# EasyEDA Pro project 2025NUEDC_A_Project.eprj, board PCB1_1
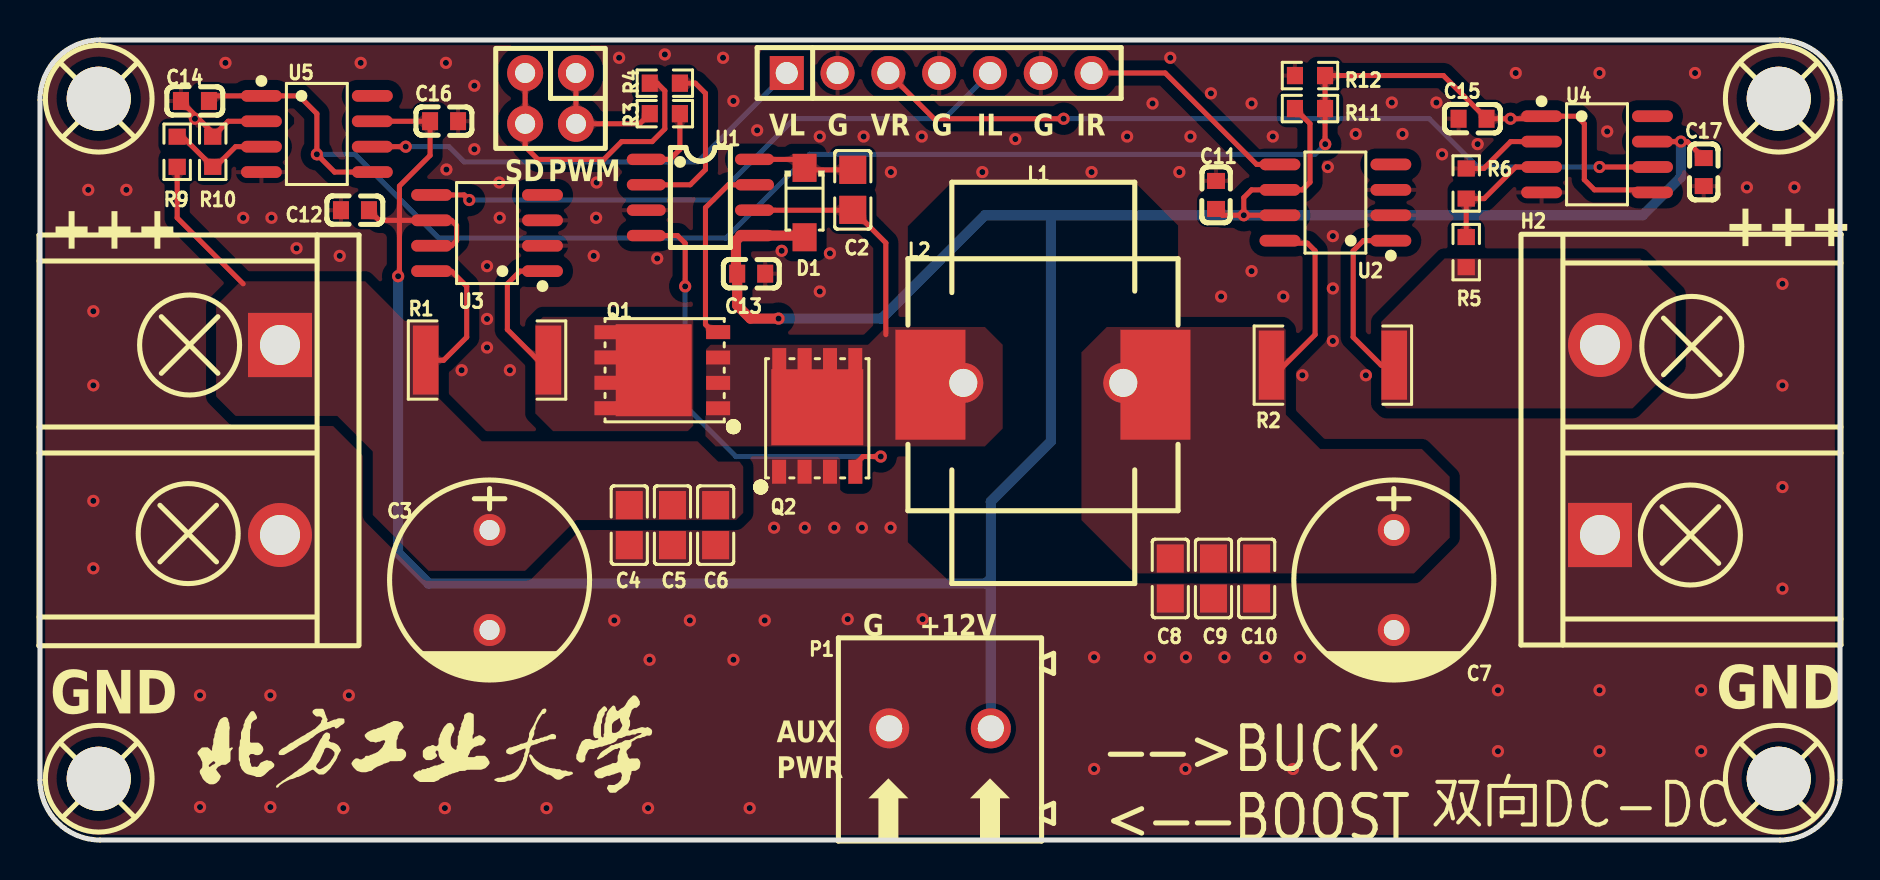
[diagram p3: board, top side]
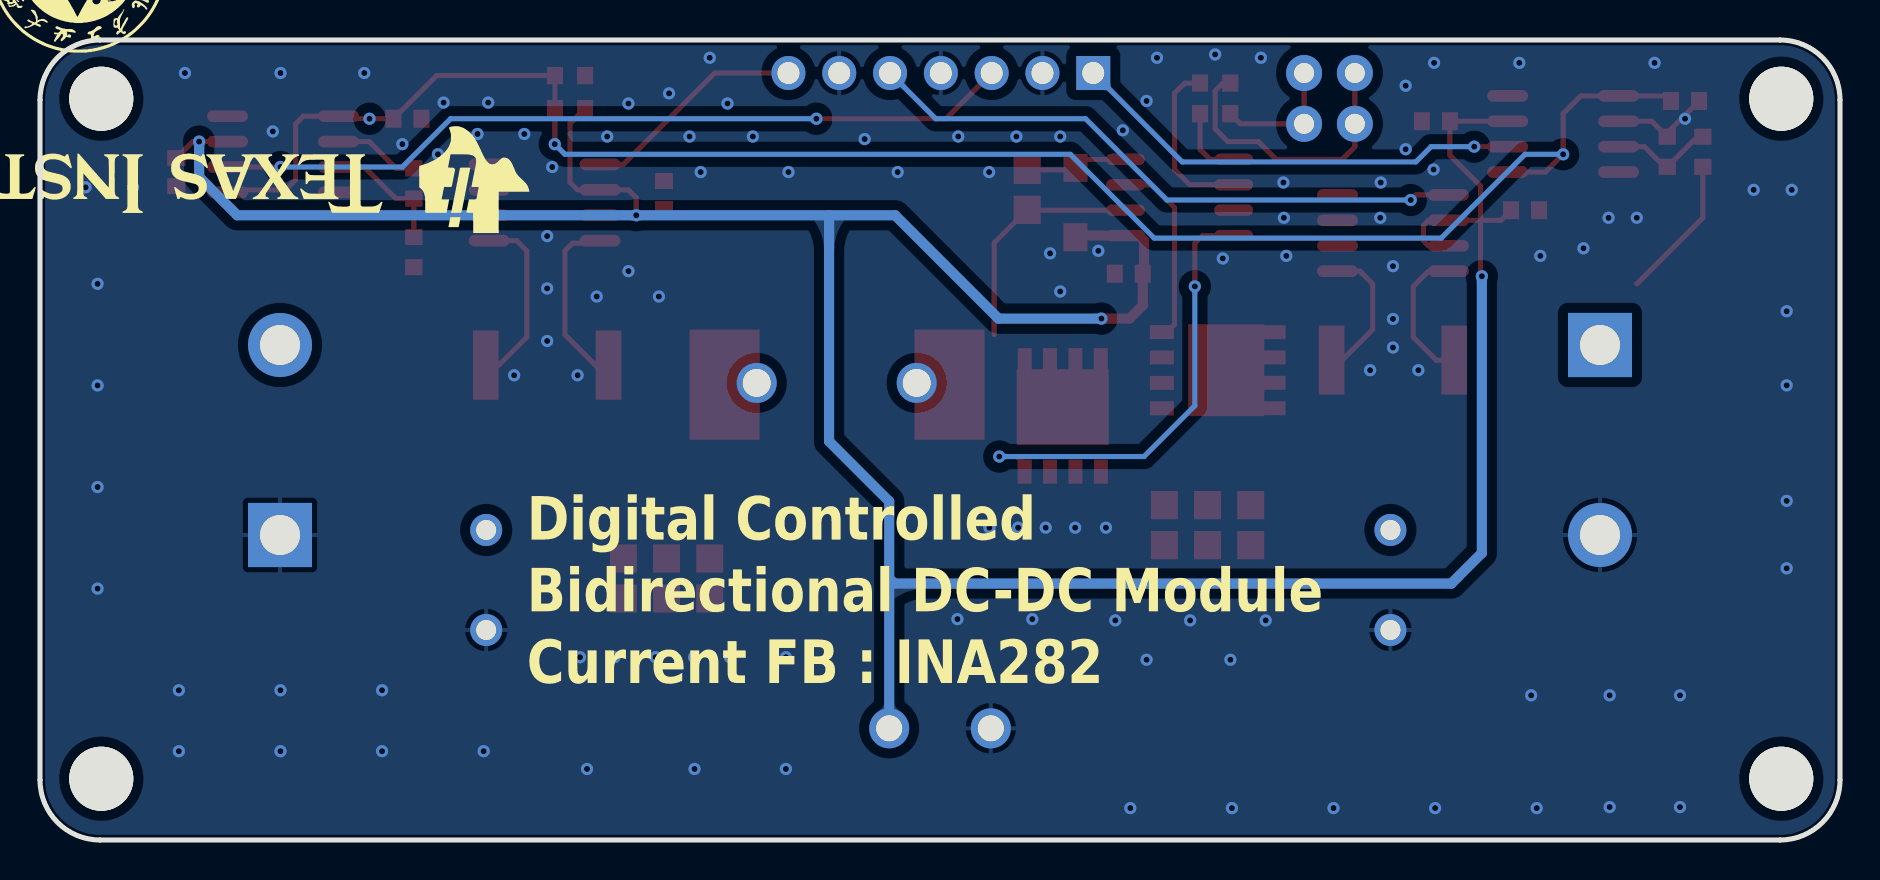
[diagram p4: board, bottom side, seen from below]

Outline 90 x 40 mm; copper layers: Top Layer, Bottom Layer. Coordinates in mm from the lower left corner of the outline.
Outline path: 0,37 0,3 arc(0.88,0.88) 3,0 87,0 arc(89.12,0.88) 90,3 90,37 arc(89.12,39.12) 87,40 3,40 arc(0.88,39.12) 0,37
Stack: Top Layer 0.035mm / Dielectric1 1.51mm FR4 er 4.5 / Bottom Layer 0.035mm

## Design rules (mm)
template: 自定义配置
spacing copperThickness1oz (default): track to track 0.102, other pairs 0.152 to 0.3
spacing copperThickness2oz: track to track 0.203, other pairs 0.152 to 0.3
track width copperThickness1oz (default): min 0.127, default 0.254, max 2.54
track width copperThickness2oz: min 0.203, default 0.254, max 2.54
differential pair differentialPair (default): width min 0.127, default 0.254, max 2.54; gap min 0.152, default 0.152
via viaSize (default): diameter min 0.5, default 0.61, max 10; hole min 0.3, default 0.305, max 6.3
pour e29 uses copperRegion1
pour e724 uses copperRegion

## Placement (name value [footprint] x y rotation side)
C2  100nF  [C0805]  40.64 32.51 270 top
C3  1000uF  [CAP-TH_BD10.0-P5.00-D0.6-FD]  22.48 13 270 top
C4  100nF  [C0805]  29.46 15.74 90 top
C5  100nF  [C0805]  31.62 15.74 90 top
C6  100nF  [C0805]  33.78 15.74 90 top
C7  1000uF  [CAP-TH_BD10.0-P5.00-D0.6-FD]  67.69 13 270 top
C8  100nF  [C0805]  56.51 13.08 90 top
C9  100nF  [C0805]  58.67 13.08 90 top
C10  100nF  [C0805]  60.83 13.08 90 top
C11  100nF  [C0603]  58.8 32.25 270 top
C12  100nF  [C0603]  15.75 31.49 0 top
C13  100nF  [C0603]  35.56 28.32 180 top
C14  10nF  [C0603]  7.75 36.95 0 top
C15  10nF  [C0603]  71.63 36.06 0 top
C16  100nF  [C0603]  20.2 35.94 0 top
C17  100nF  [C0603]  83.19 33.4 270 top
D1  DSK34  [SOD-123FL_L2.7-W1.8-LS3.8-RD]  38.23 31.87 270 top
H1  HB9500M-9.5-2P  [CONN-TH_HB9500M-9.5-2P]  12 20 270 top
H2  HB9500M-9.5-2P  [CONN-TH_HB9500M-9.5-2P]  78 20 90 top
H3  -  [HDR-TH_4P-P2.54-V-F-R2-C2-S2.54]  25.53 37.08 180 top
H5  -  [HDR-TH_7P-P2.54-V-M]  44.96 38.35 0 top
L1  47uH  [IND-TH_L20.0-W9.0-P8.00-D1.0]  50.16 22.86 0 top
L2  10uH  [IND-SMD_L13.5-W12.6_FAUL136X]  50.15 22.76 0 top
P1  WJ500V-5.08-2P  [CONN-TH_2P-P5.00_WJ500V-5.08-2P]  45 5.58 180 top
Q1  CJAC13TH06  [PDFN-8_L5.8-W4.9-P1.27-LS6.1-BL]  31.12 23.49 90 top
Q2  CJAC13TH06  [PDFN-8_L5.8-W4.9-P1.27-LS6.1-BL]  38.86 21.2 0 top
R1  10mΩ  [R2512]  22.35 24 0 top
R2  10mΩ  [R2512]  64.64 23.74 0 top
R3  22  [R0603]  31.24 36.32 0 top
R4  22  [R0603]  31.24 37.84 0 top
R5  90k  [R0603]  71.31 29.4 270 top
R6  10K  [R0603]  71.31 32.82 270 top
R9  90k  [R0603]  6.86 34.41 270 top
R10  10K  [R0603]  8.64 34.41 270 top
R11  1k  [R0603]  63.5 36.57 180 top
R12  1k  [R0603]  63.5 38.22 0 top
TP1  -  [M3螺丝]  3 37 0 top
TP2  -  [M3螺丝]  3 3 0 top
TP3  -  [M3螺丝]  87 37 0 top
TP4  -  [M3螺丝]  87 3 0 top
U1  IR2184STRPBF  [SOIC-8_L5.0-W4.0-P1.27-LS6.0-BL]  33.02 32.13 270 top
U2  INA282AIDR  [SOIC-8_L4.9-W3.9-P1.27-LS6.0-BL]  64.77 31.87 90 top
U3  INA282AIDR  [SOIC-8_L4.9-W3.9-P1.27-LS6.0-BL]  22.35 30.35 90 top
U4  INA149AIDR  [SOIC-8_L4.9-W3.9-P1.27-LS6.0-BL]  77.85 34.28 270 top
U5  INA149AIDR  [SOIC-8_L4.9-W3.9-P1.27-LS6.0-BL]  13.84 35.3 270 top

## Footprints (pads in the part's own frame, mm; a bottom-side part is the same pattern mirrored in y, then rotated)
C0603
  rect 0.8x0.9 smd: 1(-0.7,0) 2(0.7,0)
C0805
  rect 1.41x1.35 smd: 1(-1,0) 2(1,0)
CAP-TH_BD10.0-P5.00-D0.6-FD
  round 1.6 hole 1: 1(-2.5,0) 2(2.5,0)
CONN-TH_2P-P5.00_WJ500V-5.08-2P
  round 2 hole 1.3: 1(-2.54,0) 2(2.54,0)
CONN-TH_HB9500M-9.5-2P
  rect 3.21x3.2 hole 2: 1(-4.75,0)
  round 3.2 hole 2: 2(4.75,0)
HDR-TH_4P-P2.54-V-F-R2-C2-S2.54
  round 1.8 hole 1: 1(-1.27,-1.27) 2(-1.27,1.27) 3(1.27,-1.27) 4(1.27,1.27)
HDR-TH_7P-P2.54-V-M
  rect 1.7x1.7 hole 1.1: 1(-7.62,0)
  round 1.7 hole 1.1: 2(-5.08,0) 3(-2.54,0) 4(0,0) 5(2.54,0) 6(5.08,0) 7(7.62,0)
IND-SMD_L13.5-W12.6_FAUL136X
  rect 3.5x5.5 smd: 1(-5.625,0) 2(5.625,0)
IND-TH_L20.0-W9.0-P8.00-D1.0
  round 2 hole 1.4: 1(-4,0) 2(4,0)
M3螺丝
  round 3.2 hole 3.2: 1(-0.064,0.064)
PDFN-8_L5.8-W4.9-P1.27-LS6.1-BL
  rect 0.7x1.2 smd: 1(-1.905,-2.792) 2(-0.635,-2.792) 3(0.635,-2.792) 4(1.905,-2.792) 5(1.9,2.792) 6(0.64,2.792) 7(-0.63,2.792) 8(-1.9,2.792)
  rect 4.6x3.8 smd: 9(0,0.432)
R0603
  rect 0.806x0.864 smd: 1(-0.753,0) 2(0.753,0)
R2512
  rect 1.282x3.456 smd: 1(-3.067,0) 2(3.067,0)
SOD-123FL_L2.7-W1.8-LS3.8-RD
  rect 1.4x1.2 smd: 1(-1.735,0) 2(1.735,0)
SOIC-8_L4.9-W3.9-P1.27-LS6.0-BL
  oval 0.588x2.045 smd: 1(-1.905,-2.772) 2(-0.635,-2.772) 3(0.635,-2.772) 4(1.905,-2.772) 5(1.905,2.772) 6(0.635,2.772) 7(-0.635,2.772) 8(-1.905,2.772)
SOIC-8_L5.0-W4.0-P1.27-LS6.0-BL
  oval 0.569x1.95 smd: 1(-1.905,-2.705) 2(-0.635,-2.705) 3(0.635,-2.705) 4(1.905,-2.705) 5(1.905,2.705) 6(0.635,2.705) 7(-0.635,2.705) 8(-1.905,2.705)

## Nets
As in the schematic, except:
GND: C3.2 C4.1 C5.1 C6.1 C7.2 C8.1 C9.1 C10.1 C11.1 C12.1 C13.1 C14.1 C15.1 C16.2 C17.2 H1.2 H2.1 H5.2 H5.4 H5.6 P1.2 Q2.1 Q2.2 Q2.3 R6.1 R10.1 R12.1 U1.3 U2.2 U2.3 U3.2 U3.3 U4.2 U4.4 U5.2 U5.4
$1N5859: C7.1 C8.2 C9.2 C10.2 L1.2 L2.2 R2.1 U2.8

Pads without a net: TP1 1; TP2 1; TP3 1; TP4 1; U2 4; U3 4; U4 8; U5 8

## Via types
v1: diameter 0.61, hole 0.305, Top Layer to Bottom Layer, 127 vias

## Routing (per net, layer and track width the routed paths; a pad name or vN(x,y) marks a point on that pad's centre or on a via; arc(x,y) is an arc through that point)
GND: length 9.5
  Top Layer w0.254: U5.2 9.41,35.94 R10.1 8.64,35.36 C14.1 ; U4.2 73.53,34.92 72.19,33.58 R6.1
  vias: v1(2.41,32.51) v1(2.67,26.44) v1(2.67,22.73) v1(2.67,16.96) v1(2.67,13.58) v1(4.32,32.51) v1(7.75,36.06) v1(8,7.23) v1(8,1.65) v1(9.27,38.86) v1(10.16,31.11) v1(11.52,7.23) v1(11.52,1.65) v1(11.57,31.11) v1(12.83,29.59) v1(14.99,29.2) v1(15.16,1.59) v1(15.44,7.23) v1(16.03,38.86) v1(20.24,1.59) v1(20.3,38.86) v1(20.32,33.52) v1(21.08,23.49) v1(21.72,37.71) v1(21.72,34.54) v1(22.35,28.69) v1(22.35,26.05) v1(22.35,24.62) v1(22.97,32.87) v1(22.99,31.11) v1(23.5,23.49) v1(25.32,1.59) v1(27.69,29.2) v1(27.83,32.87) v1(27.81,31.11) v1(28.72,10.98) v1(28.96,39.11) v1(30.4,1.59) v1(30.48,9.01) v1(30.86,29.08) v1(31.24,39.28) v1(32.49,10.98) v1(34.15,39.11) v1(34.67,36.95) v1(34.67,9.01) v1(35.48,1.59) v1(35.86,35.48) v1(36.24,10.98) v1(36.7,15.62) v1(37.08,29.46) v1(38.24,15.62) v1(38.99,35.17) v1(38.99,27.43) v1(39.5,29.33) v1(39.71,15.62) v1(40.39,11.04) v1(41.09,15.62) v1(41.18,35.17) v1(42.54,33.4) v1(42.53,15.62) v1(44.09,35.17) v1(44.13,11.04) v1(47.12,33.4) v1(48.77,35.05) v1(52.58,33.4) v1(52.71,9.14) v1(52.71,3.55) v1(54.36,35.17) v1(55.5,9.14) v1(55.63,36.83) v1(56.51,39.11) v1(56.97,33.4) v1(57.3,9.14) v1(57.27,3.55) v1(57.52,35.17) v1(58.55,37.33) v1(59.06,27.17) v1(59.22,9.14) v1(60.58,36.83) v1(60.58,28.44) v1(61.27,9.14) v1(61.64,35.17) v1(62.16,27.17) v1(62.65,3.55) v1(63,9.14) v1(63.12,23.24) v1(64.39,33.65) v1(64.64,30.19) v1(64.64,27.58) v1(64.64,24.95) v1(65.79,35.3) v1(66.29,23.24) v1(67.59,36.87) v1(67.82,4.44) v1(68.12,35.3) v1(69.82,36.87) v1(70.1,34.28) v1(71.88,34.79) v1(72.9,7.49) v1(72.9,4.44) v1(73.79,38.35) v1(77.98,38.35) v1(77.98,7.49) v1(77.98,4.44) v1(78.36,35.43) v1(82.75,38.35) v1(83.06,7.49) v1(83.06,4.44) v1(85.34,32.63) v1(87.12,27.81) v1(87.12,22.73) v1(87.12,17.65) v1(87.12,12.57) v1(87.72,32.63)
AUXP: length 163
  Top Layer w0.254: U3.7 20.57,29.71 20.83,29.97 20.83,30.73 20.57,30.98 U3.6 17.97,30.98 ; U2.7 v1(60.19,31.24) ; v1(60.19,31.24) 60.19,32.12 60.58,32.51 U2.6 63.12,32.51 63.5,32.89 63.5,35.82 R11.2 ; v1(60.19,31.24) 59.12,31.24 C11.2 ; C12.2 16.96,30.98 17.97,30.98 ; C17.1 82.36,34.92 v1(82.05,34.92) U4.7 ; 17.97,30.98 17.97,32.7 19.5,34.23 C16.1 19.5,35.94 U5.7 ; 17.97,30.98 17.97,28.25 v1(17.91,28.19)
  Top Layer w0.508: v1(36.93,26.07) 35.52,26.07 34.86,26.73 C13.2 34.8,28.38 34.8,29.97 35.05,30.22 38.14,30.22 D1.2
  Bottom Layer w0.508: P1.1 47.54,13.08 ; 47.54,13.08 47.54,16.93 50.55,19.93 50.55,31.24 ; 47.54,13.08 47.29,12.82 19.43,12.82 17.91,14.35 v1(17.91,28.19) ; 50.55,31.24 47.24,31.24 42.08,26.07 v1(36.93,26.07) ; 50.55,31.24 v1(60.19,31.24) 80.14,31.24 82.04,33.14 82.04,34.92 v1(82.05,34.92)
HO: length 9.6
  Top Layer w0.254: 35.72,32.76 34.42,32.76 33.27,31.62 33.27,25.78 33.66,25.39 Q1.4
IFB_L: length 30.7
  Top Layer w0.254: U3.5 21.21,32.25 v1(21.46,32)
  Bottom Layer w0.254: H5.5 45.21,36.06 37.72,36.06 33.66,32 v1(21.46,32)
IFB_R: length 11.3
  Top Layer w0.254: H5.7 56.26,38.35 60.83,33.78 U2.5
LO: length 22.9
  Top Layer w0.254: Q2.4 40.77,18.79 41.15,19.17 v1(42.04,19.17) ; v1(32.26,27.68) 32.26,29.84 31.88,30.22 U1.4
  Bottom Layer w0.254: v1(32.26,27.68) 32.26,21.71 34.8,19.17 v1(42.04,19.17)
PWM: length 6.4
  Top Layer w0.254: R3.1 29.98,35.81 H3.2 H3.1
SD: length 14.4
  Top Layer w0.254: H3.3 H3.4 24.26,34.67 24.89,34.03 28.19,34.03 29.08,34.92 30.61,34.92 31.24,35.56 31.24,37.46 30.86,37.84 R4.1
VFB_L: length 22.9
  Top Layer w0.254: U5.6 v1(18.29,34.67)
  Bottom Layer w0.254: v1(18.29,34.67) 20.45,34.67 21.21,33.9 32.89,33.9 H5.1
VFB_R: length 40.2
  Top Layer w0.254: v1(77.98,33.65) U4.6 ; v1(51.18,36.06) 44.7,36.06 H5.3
  Bottom Layer w0.254: v1(51.18,36.06) 69.47,36.06 71.88,33.65 v1(77.98,33.65)
VLEFT: length 14.4
  Top Layer w0.254: U3.8 19.59,28.43 20.58,28.43 21.34,27.68 21.34,25.14 20.18,23.99 19.3,23.99 R1.1 ; R9.2 6.86,31.11 10.16,27.81
VREF: length 89.1
  Top Layer w0.254: v1(64.26,34.79) 64.25,34.8 R11.1 R12.2 70.17,38.22 C15.2 v1(73.52,36.06) 74.95,36.06 U4.1 76.84,36.19 77.22,35.81 77.22,33.02 77.72,32.51 80.5,32.51 U4.5 ; C14.2 8.7,37.21 U5.1 12.95,37.21 13.84,36.32 v1(13.84,34.28) 14.73,33.4 U5.5
  Bottom Layer w0.254: v1(13.84,34.28) 15.75,34.28 19.94,30.09 34.29,30.09 38.48,34.28 63.75,34.28 v1(64.26,34.79)
VRIGHT: length 9
  Top Layer w0.254: R2.2 67.06,23.74 65.66,25.14 65.66,29.46 66.17,29.97 U2.1
VS: length 11.8
  Top Layer w0.254: 35.72,31.49 40.62,31.49 C2.2 42.29,29.86 42.29,25.27
$1N3848: length 5.1
  Top Layer w0.254: C2.1 38.33,33.51 D1.1 37.8,34.03 35.72,34.03
$1N5859: length 9.1
  Top Layer w0.254: R2.1 61.7,23.62 62.1,23.62 63.75,25.27 63.75,29.46 63.37,29.84 62.12,29.84 U2.8
$1N7080: length 7
  Top Layer w0.254: U3.1 24,28.44 23.37,27.81 23.37,25.52 24.89,24 R1.2
$1N8011: length 3.7
  Top Layer w0.254: R3.2 32,34.53 31.5,34.03 U1.1
$1N8015: length 8.6
  Top Layer w0.254: R4.2 32.77,37.84 33.27,37.33 33.27,33.52 32.51,32.76 30.31,32.76
$1N11764: length 6.3
  Top Layer w0.254: R5.1 R6.2 72.21,32.07 73.79,33.65 U4.3
$1N12012: length 5.3
  Top Layer w0.254: R9.1 7.13,35.17 R10.2 8.77,33.66 9.78,34.67 U5.3

## Copper pours and planes (outline as drawn; the poured copper is in the pictures)
GND on Top Layer: 8.76,19.05 9.78,20.06 14.1,20.06 15.62,18.54 15.62,15.49 18.67,12.44 24.77,12.44 27.81,15.49 35.74,15.49 35.74,18.72 36.19,19.17 39.88,19.17 40,19.05 40,16.25 43.43,12.82 69.85,12.82 76.71,19.68 92.2,19.68 92.2,0 12.96,0 12.95,0 12.95,9.01 8.76,13.2
GND on Top Layer: -6.48,47.75 106.55,47.75 106.55,-14.86 -6.48,-14.86
GND on Bottom Layer: -14.35,49.27 102.36,49.27 102.36,-6.86 -14.35,-6.86
VLEFT on Top Layer: 8.8,27.94 35.16,27.94 35.16,13.46 8.8,13.46
VRIGHT on Top Layer: 67.06,29.08 81.79,29.08 81.79,21.58 67.06,21.58
VS on Top Layer: 33.27,25.65 48.13,25.65 48.13,19.68 33.27,19.68
$1N5859 on Top Layer: 52.07,25.65 70.49,25.65 70.49,13.33 52.07,13.33
$1N7080 on Top Layer: 24.77,26.16 32.66,26.16 32.66,20.44 24.77,20.44

Small or netless copper shapes (teardrops, artwork), in the pictures only: 95 on Top Layer, 17 on Bottom Layer

## Text on the board
Bottom Silkscreen Layer: Digital Controlled / Bidirectional DC-DC Module / Current FB : INA282
Top Silkscreen Layer: SD | PWM | VL | AUX / PWR | G | G    +12V | VR | IL | IR | +++ | GND | ——>BUCK / <——BOOST | 双向DC-DC
